# EAGLE design 20KV Diode (EAGLE 7.2.0)
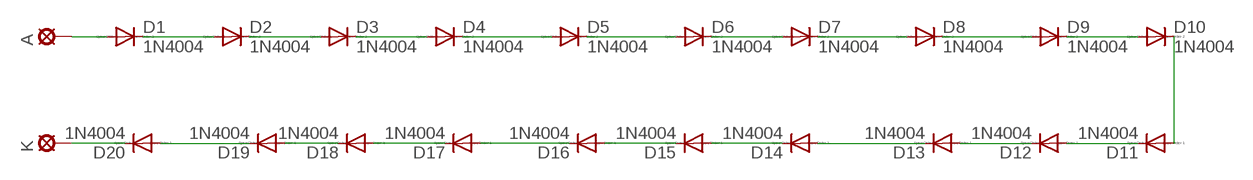
[diagram p0: schematic, sheet 1]

## Parts
A  LSP10  [LSP10]
D1  1N4004  [DO41-10]
D2  1N4004  [DO41-10]
D3  1N4004  [DO41-10]
D4  1N4004  [DO41-10]
D5  1N4004  [DO41-10]
D6  1N4004  [DO41-10]
D7  1N4004  [DO41-10]
D8  1N4004  [DO41-10]
D9  1N4004  [DO41-10]
D10  1N4004  [DO41-10]
D11  1N4004  [DO41-10]
D12  1N4004  [DO41-10]
D13  1N4004  [DO41-10]
D14  1N4004  [DO41-10]
D15  1N4004  [DO41-10]
D16  1N4004  [DO41-10]
D17  1N4004  [DO41-10]
D18  1N4004  [DO41-10]
D19  1N4004  [DO41-10]
D20  1N4004  [DO41-10]
K  LSP10  [LSP10]

## Nets
N$1: D9.C D10.A
N$2: D14.C D15.A
N$3: D15.C D16.A
N$4: D16.C D17.A
N$5: D17.C D18.A
N$6: D18.C D19.A
N$7: A.MP D1.A
N$8: D20.C K.MP
N$9: D1.C D2.A
N$10: D2.C D3.A
N$11: D3.C D4.A
N$12: D4.C D5.A
N$13: D5.C D6.A
N$14: D6.C D7.A
N$15: D7.C D8.A
N$16: D8.C D9.A
N$17: D10.C D11.A
N$18: D11.C D12.A
N$19: D12.C D13.A
N$20: D13.C D14.A
N$21: D19.C D20.A

## Library data of the parts
A K = solpad:LSP10: SOLDER PAD drill 1.0 mm, distributor Buerklin, 12H555
D1-D20 = diode:1N4004: DIODE general purpose rectifier, 1 A

## Board
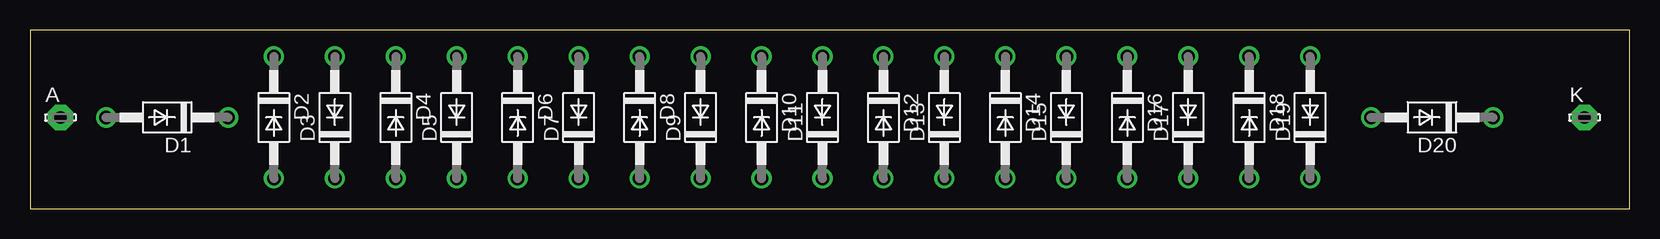
[diagram p1: board, top side]
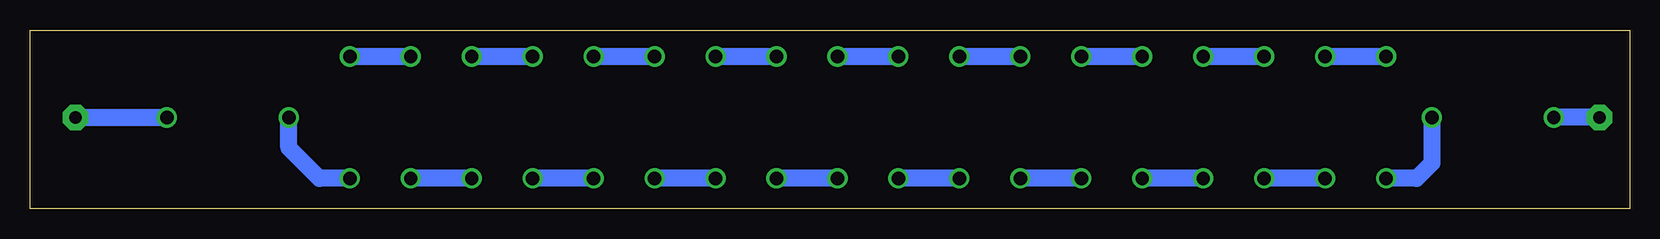
[diagram p2: board, bottom side, seen from below]

Size 133.33 x 14.91 mm. Coordinates in mm from the lower left corner, seen from the top.
Outline: 0,0 133.33,0 133.33,14.91 0,14.91 0,0
Copper layers (1*16): Top 0.035mm / dielectric 1.5mm / Bottom 0.035mm
Design rules "default": minimum track width 10mil, minimum drill 24mil, track to track 8mil, track to pad 8mil, pad to pad 8mil, via to via 8mil, smd to smd 8mil, copper to edge 40mil, drill to drill 8mil, minimum pad ring 10mil, minimum via ring 8mil, stop-mask expansion 4mil, vias tented up to drill 0mil, thermal gap 10mil

### Footprints (pad centres in the part's own frame; a part is rotated, then mirrored left to right if it is on the bottom)
LSP10 = drill 1.016 pad 2.159 octagon: MP 0,0
DO41-10 = drill 1.118: A 5.08,0; C -5.08,0

### Placement (x,y rotation side)
A  2.54,7.62 0 top
D1  11.43,7.62 180 top
D2  20.32,7.62 270 top
D3  25.4,7.62 90 top
D4  30.48,7.62 270 top
D5  35.56,7.62 90 top
D6  40.64,7.62 270 top
D7  45.72,7.62 90 top
D8  50.8,7.62 270 top
D9  55.88,7.62 90 top
D10  60.96,7.62 270 top
D11  66.04,7.62 90 top
D12  71.12,7.62 270 top
D13  76.2,7.62 90 top
D14  81.28,7.62 270 top
D15  86.36,7.62 90 top
D16  91.44,7.62 270 top
D17  96.52,7.62 90 top
D18  101.6,7.62 270 top
D19  106.68,7.62 90 top
D20  116.84,7.62 180 top
K  129.54,7.62 0 top

### Tracks (layer width: path | path; a pad name or v marks a point on that pad's centre or on a via)
N$1
  Bottom 1.422: D9.C D10.A
N$2
  Bottom 1.422: D14.C D15.A
N$3
  Bottom 1.422: D15.C D16.A
N$4
  Bottom 1.422: D16.C D17.A
N$5
  Bottom 1.422: D17.C D18.A
N$6
  Bottom 1.422: D18.C D19.A
N$7
  Bottom 1.422: A.MP D1.A
N$8
  Bottom 1.422: K.MP D20.C
N$9
  Bottom 1.422: D1.C 16.51,3.81 17.78,2.54 D2.A
N$10
  Bottom 1.422: D2.C D3.A
N$11
  Bottom 1.422: D3.C D4.A
N$12
  Bottom 1.422: D4.C D5.A
N$13
  Bottom 1.422: D5.C D6.A
N$14
  Bottom 1.422: D6.C D7.A
N$15
  Bottom 1.422: D7.C D8.A
N$16
  Bottom 1.422: D8.C D9.A
N$17
  Bottom 1.422: D10.C D11.A
N$18
  Bottom 1.422: D11.C D12.A
N$19
  Bottom 1.422: D12.C D13.A
N$20
  Bottom 1.422: D13.C D14.A
N$21
  Bottom 1.422: D19.C 109.22,2.54 111.76,5.08 D20.A